# Altium project EL00016-AC Accumulator High Voltage PCB -Ethan Edit.PrjPcb (part 1 of 2)
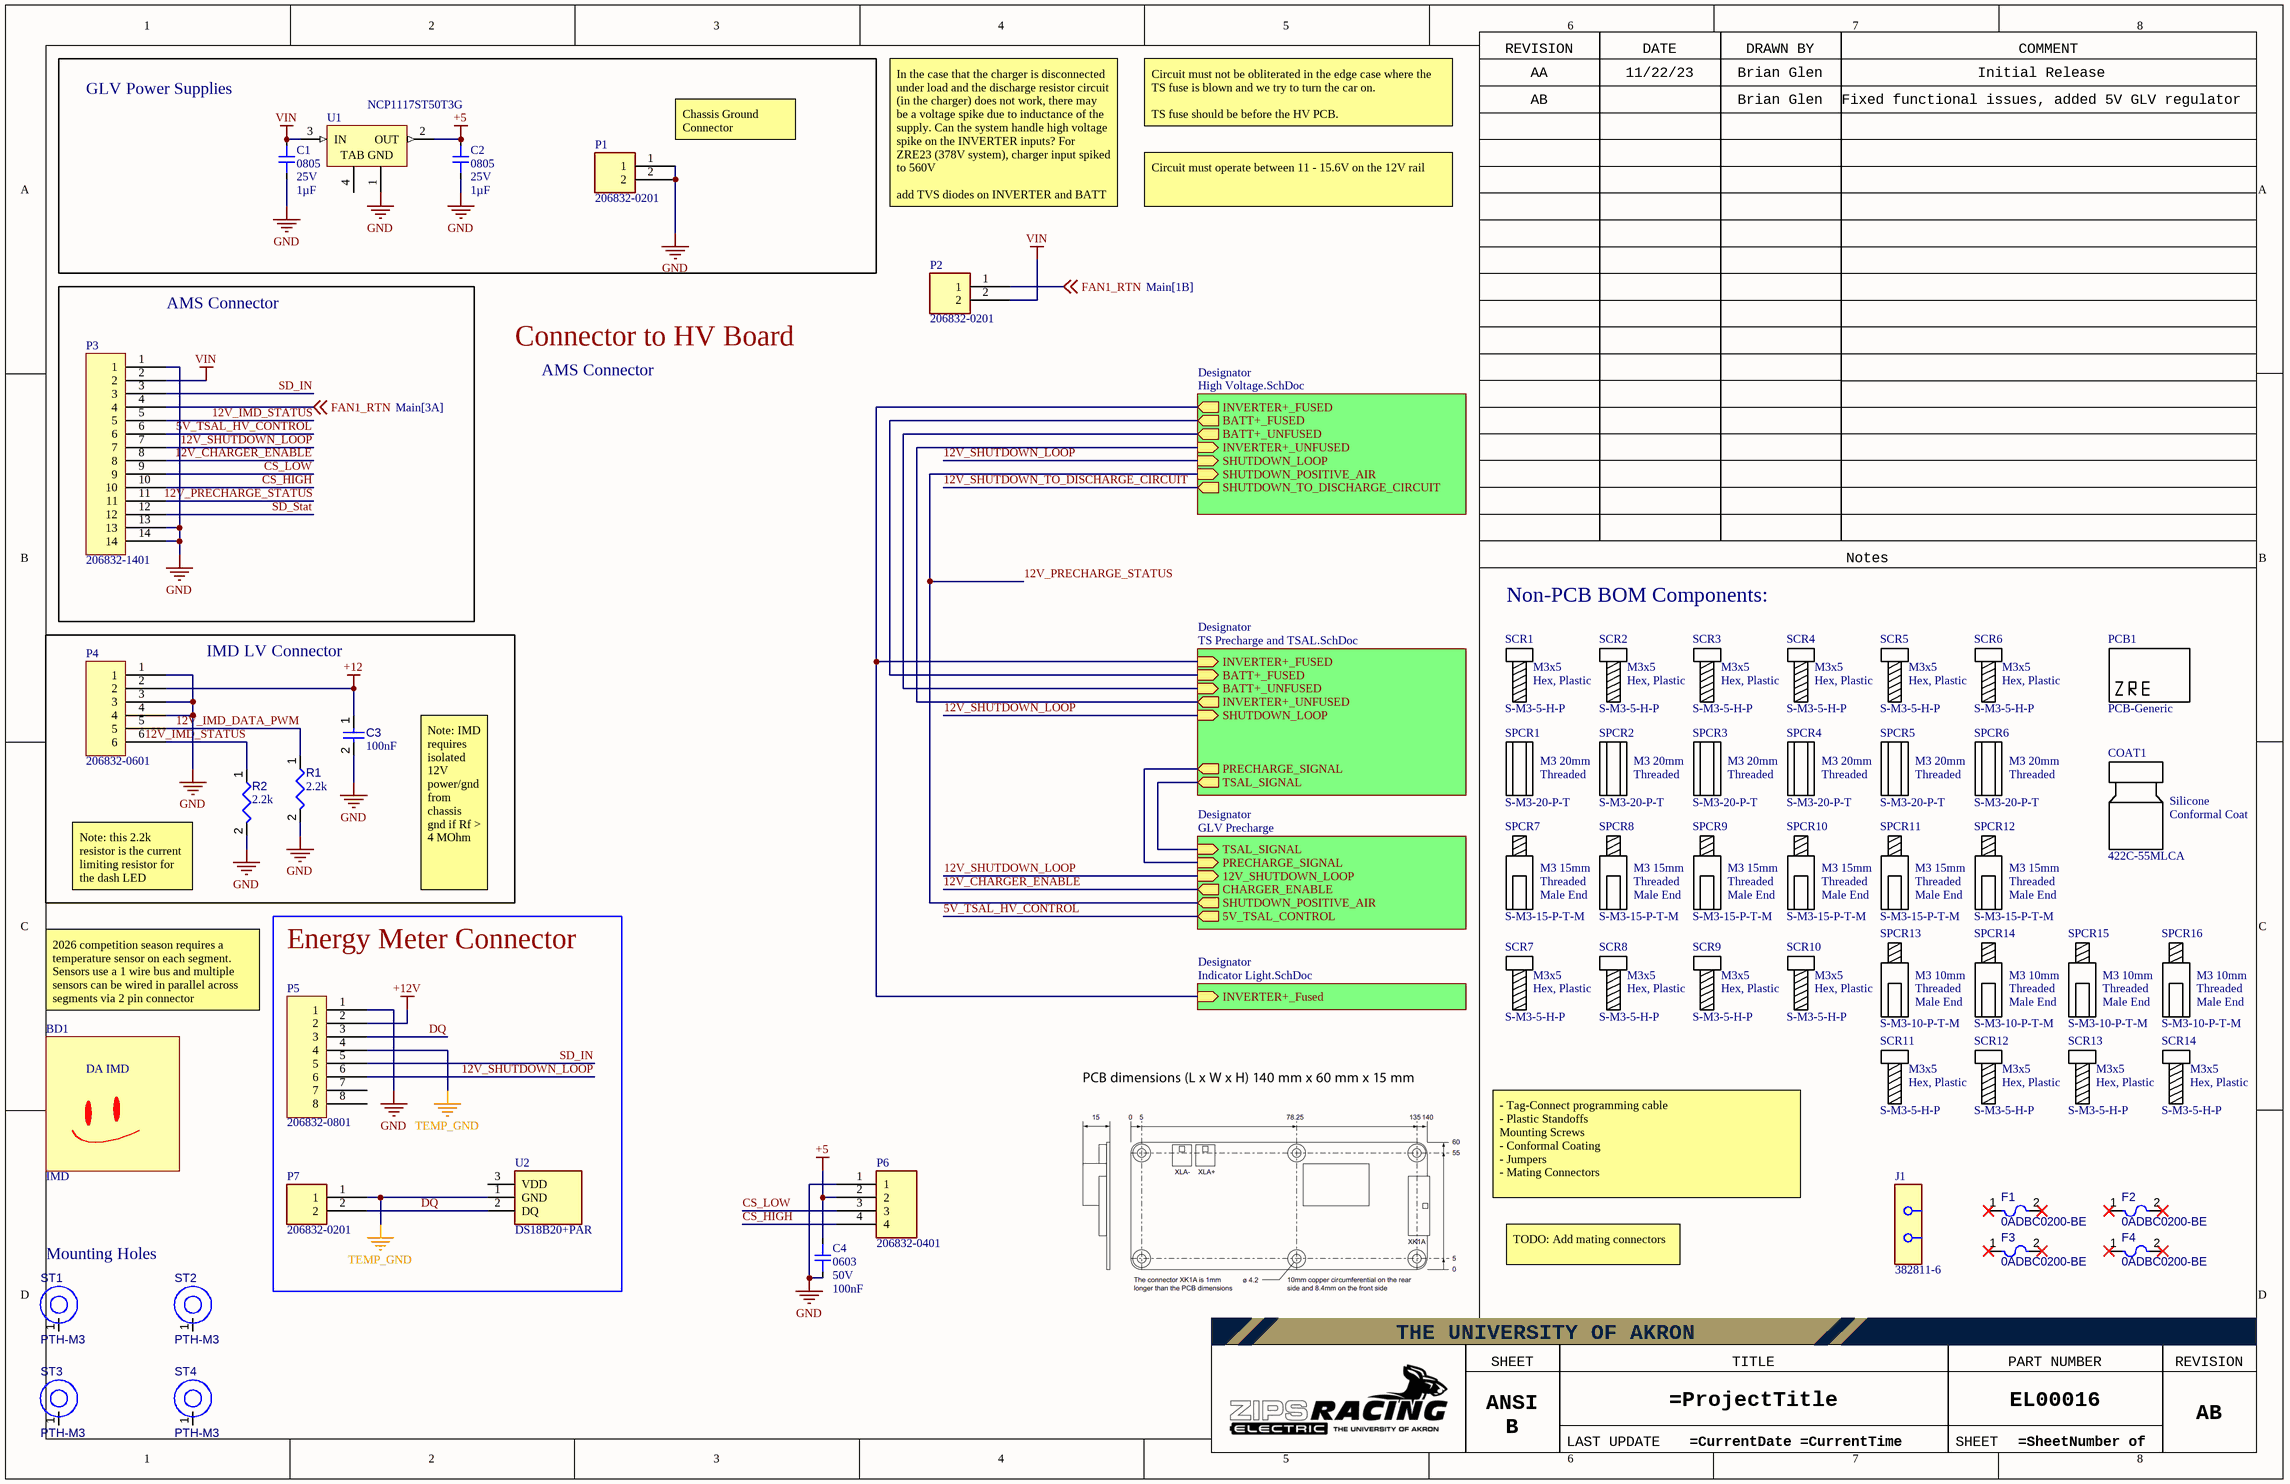
[diagram p0: Main.SchDoc]
Comment_1: Initial Release; Comment_2: Fixed functional issues, added 5V GLV regulator; Date_1: 11/22/23; DrawnBy_1: Brian Glen; DrawnBy_2: Brian Glen; PartNumber: EL00016; ProjectTitle: Accumulator High Voltage PCB; Revision: AB; Revision_1: AA; Revision_2: AB
5 sheets, 186 parts. Net scope: hierarchical (ports join the sheet entries above them; power ports are global).
Board file: PCB.PcbDoc
Sheets:
  Main.SchDoc
    Designator = TS Precharge and TSAL.SchDoc
    Designator = Indicator Light.SchDoc
    Designator = High Voltage.SchDoc
    Designator = GLV Precharge.SchDoc

## Sheet Main.SchDoc
size Tabloid; SheetNumber: 1; SheetTotal: 5

### Parts
BD1  IMD  [IMD-Footprint-1]
C1  value 1µF  Footprint: 0805  Voltage: 25V  [CAP-0805]  (hidden comment: Capacitor 1uF 0805 25V)
C2  value 1µF  Footprint: 0805  Voltage: 25V  [CAP-0805]  (hidden comment: Capacitor 1uF 0805 25V)
C3  value 100nF  [CAPC1608X90X40NL10T20]  (hidden comment: Capacitor 100 nF +/-10% 50 V 0603)
C4  value 100nF  Footprint: 0603  Voltage: 50V  [CAP-0603-Generic]  (hidden comment: Capacitor 100nF 0603 5%)
COAT1  422C-55MLCA  (mechanical)
F1  0ADBC0200-BE  (mechanical)
F2  0ADBC0200-BE  (mechanical)
F3  0ADBC0200-BE  (mechanical)
F4  0ADBC0200-BE  (mechanical)
J1  382811-6  [FP-382811-6-MFG]  (mechanical)
P1  206832-0201  [FP-206832-0201-MFG]
P2  206832-0201  [FP-206832-0201-MFG]
P3  206832-1401  [206832-1001-Footprint-1]
P4  206832-0601  [FP-206832-0601-MFG]
P5  206832-0801  [Copy of 206832-1001-Footprint-1]
P6  206832-0401  [MOLEX_2068320401]
P7  206832-0201  [FP-206832-0201-MFG]
PCB1  PCB-Generic  (mechanical)
R1  value 2.2k  [RESC1608X55X25LL10T15]  (hidden comment: Resistor 2.2k +/-1% 0603 100mW)
R2  value 2.2k  [RESC1608X55X25LL10T15]  (hidden comment: Resistor 2.2k +/-1% 0603 100mW)
SCR1  S-M3-5-H-P  (mechanical)
SCR2  S-M3-5-H-P  (mechanical)
SCR3  S-M3-5-H-P  (mechanical)
SCR4  S-M3-5-H-P  (mechanical)
SCR5  S-M3-5-H-P  (mechanical)
SCR6  S-M3-5-H-P  (mechanical)
SCR7  S-M3-5-H-P  (mechanical)
SCR8  S-M3-5-H-P  (mechanical)
SCR9  S-M3-5-H-P  (mechanical)
SCR10  S-M3-5-H-P  (mechanical)
SCR11  S-M3-5-H-P  (mechanical)
SCR12  S-M3-5-H-P  (mechanical)
SCR13  S-M3-5-H-P  (mechanical)
SCR14  S-M3-5-H-P  (mechanical)
SPCR1  S-M3-20-P-T  (mechanical)
SPCR2  S-M3-20-P-T  (mechanical)
SPCR3  S-M3-20-P-T  (mechanical)
SPCR4  S-M3-20-P-T  (mechanical)
SPCR5  S-M3-20-P-T  (mechanical)
SPCR6  S-M3-20-P-T  (mechanical)
SPCR7  S-M3-15-P-T-M  (mechanical)
SPCR8  S-M3-15-P-T-M  (mechanical)
SPCR9  S-M3-15-P-T-M  (mechanical)
SPCR10  S-M3-15-P-T-M  (mechanical)
SPCR11  S-M3-15-P-T-M  (mechanical)
SPCR12  S-M3-15-P-T-M  (mechanical)
SPCR13  S-M3-10-P-T-M  (mechanical)
SPCR14  S-M3-10-P-T-M  (mechanical)
SPCR15  S-M3-10-P-T-M  (mechanical)
SPCR16  S-M3-10-P-T-M  (mechanical)
ST1  PTH-M3  [PTH-M2D5X5]  (no BOM)
ST2  PTH-M3  [PTH-M2D5X5]  (no BOM)
ST3  PTH-M3  [PTH-M2D5X5]  (no BOM)
ST4  PTH-M3  [PTH-M2D5X5]  (no BOM)
U1  NCP1117ST50T3G  [ONSC-SOT-223-4-318H-01_A_V]
U2  DS18B20+PAR  [New footprint 1]

### Blocks framed on the sheet
GLV Power Supplies: C1 C2 P1 U1
AMS Connector: P3
IMD LV Connector: C3 P4 R1 R2
Energy Meter Connector: P5 P7 U2

### Sub-sheets
Designator = TS Precharge and TSAL.SchDoc: SHUTDOWN_LOOP (in), BATT+_UNFUSED (in), INVERTER+_UNFUSED (out), INVERTER+_FUSED (in), BATT+_FUSED (in), PRECHARGE_SIGNAL (out), TSAL_SIGNAL (out)
Designator = Indicator Light.SchDoc: INVERTER+_Fused (in)
Designator = High Voltage.SchDoc: SHUTDOWN_LOOP (in), SHUTDOWN_POSITIVE_AIR (in), SHUTDOWN_TO_DISCHARGE_CIRCUIT (out), INVERTER+_FUSED (out), BATT+_FUSED (out), BATT+_UNFUSED (out), INVERTER+_UNFUSED (in)
Designator = GLV Precharge: 5V_TSAL_CONTROL (out), SHUTDOWN_POSITIVE_AIR (out), CHARGER_ENABLE (out), PRECHARGE_SIGNAL (in), TSAL_SIGNAL (in), 12V_SHUTDOWN_LOOP (in)

### Nets
+5: C2.2 C4.2 P6.2 U1.2(OUT)
+12: C3.1 P4.2
+12V: P5.2
GND: C1.1 C2.1 C3.2 C4.1 P1.1 P1.2 P3.1 P3.13 P3.14 P4.1 P4.3 P4.4 P5.1 P6.1 R1.2 R2.2 U1.1(GND)
TEMP_GND: P5.4 P7.1 U2.1(GND)
VIN: C1.2 P2.2 P3.2 U1.3(IN)
5V_TSAL_HV_CONTROL: P3.6 ; sheet Designator/5V_TSAL_CONTROL
12V_CHARGER_ENABLE: P3.8 ; sheet Designator/CHARGER_ENABLE
12V_IMD_DATA_PWM: P4.5 R1.1
12V_IMD_STATUS: P3.5 P4.6 R2.1
12V_PRECHARGE_STATUS: P3.11 ; sheet Designator/SHUTDOWN_POSITIVE_AIR, sheet Designator/SHUTDOWN_POSITIVE_AIR
12V_SHUTDOWN_LOOP: P3.7 P5.6 ; sheet Designator/SHUTDOWN_LOOP, sheet Designator/SHUTDOWN_LOOP, sheet Designator/12V_SHUTDOWN_LOOP
12V_SHUTDOWN_TO_DISCHARGE_CIRCUIT: sheet Designator/SHUTDOWN_TO_DISCHARGE_CIRCUIT
BATT+_FUSED: sheet Designator/BATT+_FUSED, sheet Designator/BATT+_FUSED
BATT+_UNFUSED: sheet Designator/BATT+_UNFUSED, sheet Designator/BATT+_UNFUSED
CS_HIGH: P3.10 P6.4
CS_LOW: P3.9 P6.3
DQ: P5.3 P7.2 U2.2(DQ)
FAN1_RTN: P2.1 P3.4 ; off-sheet FAN1_RTN
INVERTER+_FUSED: sheet Designator/INVERTER+_FUSED, sheet Designator/INVERTER+_Fused, sheet Designator/INVERTER+_FUSED
INVERTER+_UNFUSED: sheet Designator/INVERTER+_UNFUSED, sheet Designator/INVERTER+_UNFUSED
SD_IN: P3.3 P5.5
SD_Stat: P3.12
NetR45_1: sheet Designator/PRECHARGE_SIGNAL, sheet Designator/PRECHARGE_SIGNAL
NetR46_1: sheet Designator/TSAL_SIGNAL, sheet Designator/TSAL_SIGNAL

Not connected (* = marked no-connect by the designer): F1 1* 2*; F2 1* 2*; F3 1* 2*; F4 1* 2*; P5 7 8; ST1 1(H1); ST2 1(H1); ST3 1(H1); ST4 1(H1); U1 4(TAB); U2 3(VDD)

### Notes on the sheet
- (near P1) Chassis Ground Connector
- Circuit must not be obliterated in the edge case where the TS fuse is blown and we try to turn the car on.
  TS fuse should be before the HV PCB.
- In the case that the charger is disconnected under load and the discharge resistor circuit (in the charger) does not work, there may be a voltage spike due to inductance of the supply. Can the system handle high voltage spike on the INVERTER inputs? For ZRE23 (378V system), charger input spiked to 560V
  add TVS diodes on INVERTER and BATT inputs, after fuses.
- Circuit must operate between 11 - 15.6V on the 12V rail
- Connector to HV Board
- AMS Connector
- Non-PCB BOM Components:
- Note: this 2.2k resistor is the current limiting resistor for the dash LED
- Note: IMD requires isolated 12V power/gnd from chassis gnd if Rf > 4 MOhm
- (near BD1) 2026 competition season requires a temperature sensor on each segment. Sensors use a 1 wire bus and multiple sensors can be wired in parallel across segments via 2 pin connector
- - Tag-Connect programming cable
  - Plastic Standoffs
  Mounting Screws
  - Conformal Coating
  - Jumpers
  - Mating Connectors
- Mounting Holes
- TODO: Add mating connectors
- REVISION
- DATE
- DRAWN BY
- COMMENT
- Notes
- THE UNIVERSITY OF AKRON
- SHEET SIZE
- TITLE
- PART NUMBER
- ANSI B
- LAST UPDATE
- SHEET
- (in symbol CMP-00028-00010-4) M3x5; Hex, Plastic
- (in symbol CMP-00028-00013-1) M3 20mm; Threaded
- (in symbol CMP-00028-00014-2) M3 15mm; Threaded; Male End
- (in symbol CMP-00028-00015-1) M3 10mm; Threaded; Male End
- (in symbol CMP-00030-00004-3) Silicone; Conformal Coat
- (in symbol CMP-00035-4) DA IMD

### Library data of the parts
BD1 = CMP-00035-4: IMD for the CAR
C1 C2 = CMP-00045-1: Capacitor, 0805
C3 = CMP-001-00017-6: Chip Capacitor, 100 nF, +/- 10%, 50 V, 0603 (1608 Metric); Voltage Rating: 50V; Capacitor Type: Ceramic; Tolerance: 10%; Mounting Technology: SM; Max Operating Temperature: 125°C; RoHS Compliant: True; Pins: 2; Case/Package: 0603; Min Operating Temperature: -55°C
C4 = CMP-00030-2: Capacitor, 0603, 5%; Max Operating Temperature: 125°C; Min Operating Temperature: -55°C
COAT1 = CMP-00030-00004-3: Silicone Conformal Coating, MG Chemicals, Clear, UL94 V-0, high Temperature, UV indicator, 55mL, Conform, Coat
F1-F4 = CMP-005-00015-1: Electric Fuse, Fast Blow, 0.2A, 1000VAC, 1000VDC, 0.2A (IR), Inline/holder, 6x32mm; RoHS Compliant: Yes
J1 = CMP-00030-00005-2: 2-Pin Header Pin Jumper, 0.1" pitch, Shunts/Jumper Connector; Body Length: 2.498inch; Contact Pattern: RECTANGULAR; Body Breadth: 0.2inch; Body Depth: 0.25inch; Number of Contacts: 2; Reliability: COMMERCIAL; Number Of Connectors: 1; Dielectric Withstanding Voltage (DC): 1kV; Durability: 25Cycles; Mating Contact Pitch: 0.1inch; Reference Standard: UL; Contact Resistance: 15mR; Connector Type: Interconnection Device; Insulation Resistance: 1GR; Plating Thickness: 15uin; Rated Current (Signal): 3A; Body/Shell Style: PLUG; Contact Style: SQ PIN-SKT; Contact Gender: Female; Contact Finish - Mating: AU ON NI; Insulation Material: Glass; Reach SVHC Compliant: Yes; Insulation Color: Black; Number of Rows Loaded: 1; RoHS Compliant: Yes; Mounting Style: STRAIGHT; Max Operating Temperature: 105°C; Contact Material: Bronze; Min Operating Temperature: -65°C
P1 P2 P7 = CMP-002-00123-3: Molex, Micro-Fit+, 2 Position, Dual-Row, Header, Male, 3mm Pitch; Max Current Rating: 13A; Voltage Rating: 600V
P3 = CMP-002-00137-1: MICRO-FIT Plus Header Assembly Dual Row 10 Position Straight Tin
P4 = CMP-002-00091-5: Molex, Micro-Fit+, 6 Position, Dual-Row, Header, Male, 3mm Pitch; Connector Type: PCB Header; Voltage Rating: 600V; Max Current Rating: 12.5A; Max Operating Temperature: 104°C; Pins: 6; Mounting Technology: Thru-hole; Gender: Male; Min Operating Temperature: -40°C
P5 = CMP-002-00132-2: MICRO-FIT Plus Header Assembly Dual Row 8 Position Straight Tin
P6 = CMP-002-00114-6: Micro-Fit+ Vertical Header, Through Hole, 3.00mm Pitch, Dual Row, 4 Circuits, Tin (Sn) Plating, Glow-Wire Capable, Black, Tray; Voltage Rating: 600V; Max Current Rating: 12.5A; Rows: 2; Mating Cycls: 25; Connector Type: PCB Header; Gender: Male; ComponentLink1Description: Datasheet; ComponentLink1URL: https://www.molex.com/en-us/products/part-detail/2068320401?display=pdf; Max Operating Temperature: 105°C; Plating Material: Tin; Mounting Technology: Thru-hole; Min Operating Temperature: -40°C; Pins: 4
PCB1 = CMP-00028-00012-1: Generic PCB Component for BOM inclusion
R1 R2 = CMP-009-00198-1: Description Chip Resistor, 2.2 KOhm, +/-1%, 0.1 W, -55 to 155 degC, 0603 (1608 Metric); Temperature Coefficient: 100ppm/°C; Rated Temperature: 70°C; Tolerance: 1%; Working Voltage: 75V; Case/Package: 0603; Power: 100mW; Mounting Technology: Surface Mount; Min Operating Temperature: -55°C; Max Operating Temperature: 155°C; RoHS Compliant: Yes; Pins: 2
SCR1-SCR14 = CMP-00028-00010-4: Generic Screw, M3, 5mm length, Hex Head, Plastic; Thread Pitch: 0.8mm; Material: Plastic; Pins: 0; Length: 5mm; Head Type: Hex; Thread Size: M3
SPCR1-SPCR6 = CMP-00028-00013-1: Generic M3 Spacer, 10 mm length, plastic, threaded; Pins: 0
SPCR7-SPCR12 = CMP-00028-00014-2: Generic M3 Spacer, 15 mm length, plastic, threaded, one male end; Pins: 0
SPCR13-SPCR16 = CMP-00028-00015-1: Generic M3 Spacer, 10 mm length, plastic, threaded, one male end; Pins: 0
ST1-ST4 = CMP-00028-00008-5: M3 Plated Thru-Hole  (3.2mm), 7mm pad, 10 mm keep out zone; Pins: 1
U1 = CMP-019-00031-3: Low-Dropout Positive Fixed Voltage Regulator, 1 A, 5 V Vout, 0 to 125 degC, 4-Pin SOT-223, Pb-Free, Tape and Reel; Manufacturer: ON Semiconductor; Current Rating: -600A; Output Voltage: 5V; Max Ouput Current: 1A; Max Input Voltage: 20V; Outputs: 1; Dropout Voltage: 1.2V; Min Input Voltage: 3.5V; Datasheet Version: Rev. 26, 08/2013; Package Quantity: 4000; Package Description: 4-Pin Small Outline Transistor, Body 6.5 x 3.5 mm, Pitch 2.3 mm; RoHS Compliant: True; Max Operating Temperature: 125°C; Nominal Output Voltage: 5V; Datasheet URL: https://datasheet.ciiva.com/28483/1748260-28483320.pdf; Min Operating Temperature: 0°C; Manufacturer URL: http://www.onsemi.com/; Output Current: 1A; Pins: 3; Mounting Technology: SM; Package Reference: SOT-223-4-318H-01_A; Case/Package: TO-261-4; Packaging: TapeandReel
U2 = CMP-015-00013-3: Serial Switch/Digital Sensor, 12 Bit(s), 0.50Cel, Rectangular, 3 Pin, Through Hole Mount

## Sheet TS Precharge and TSAL.SchDoc
size Tabloid; SheetNumber: 3; SheetTotal: 5
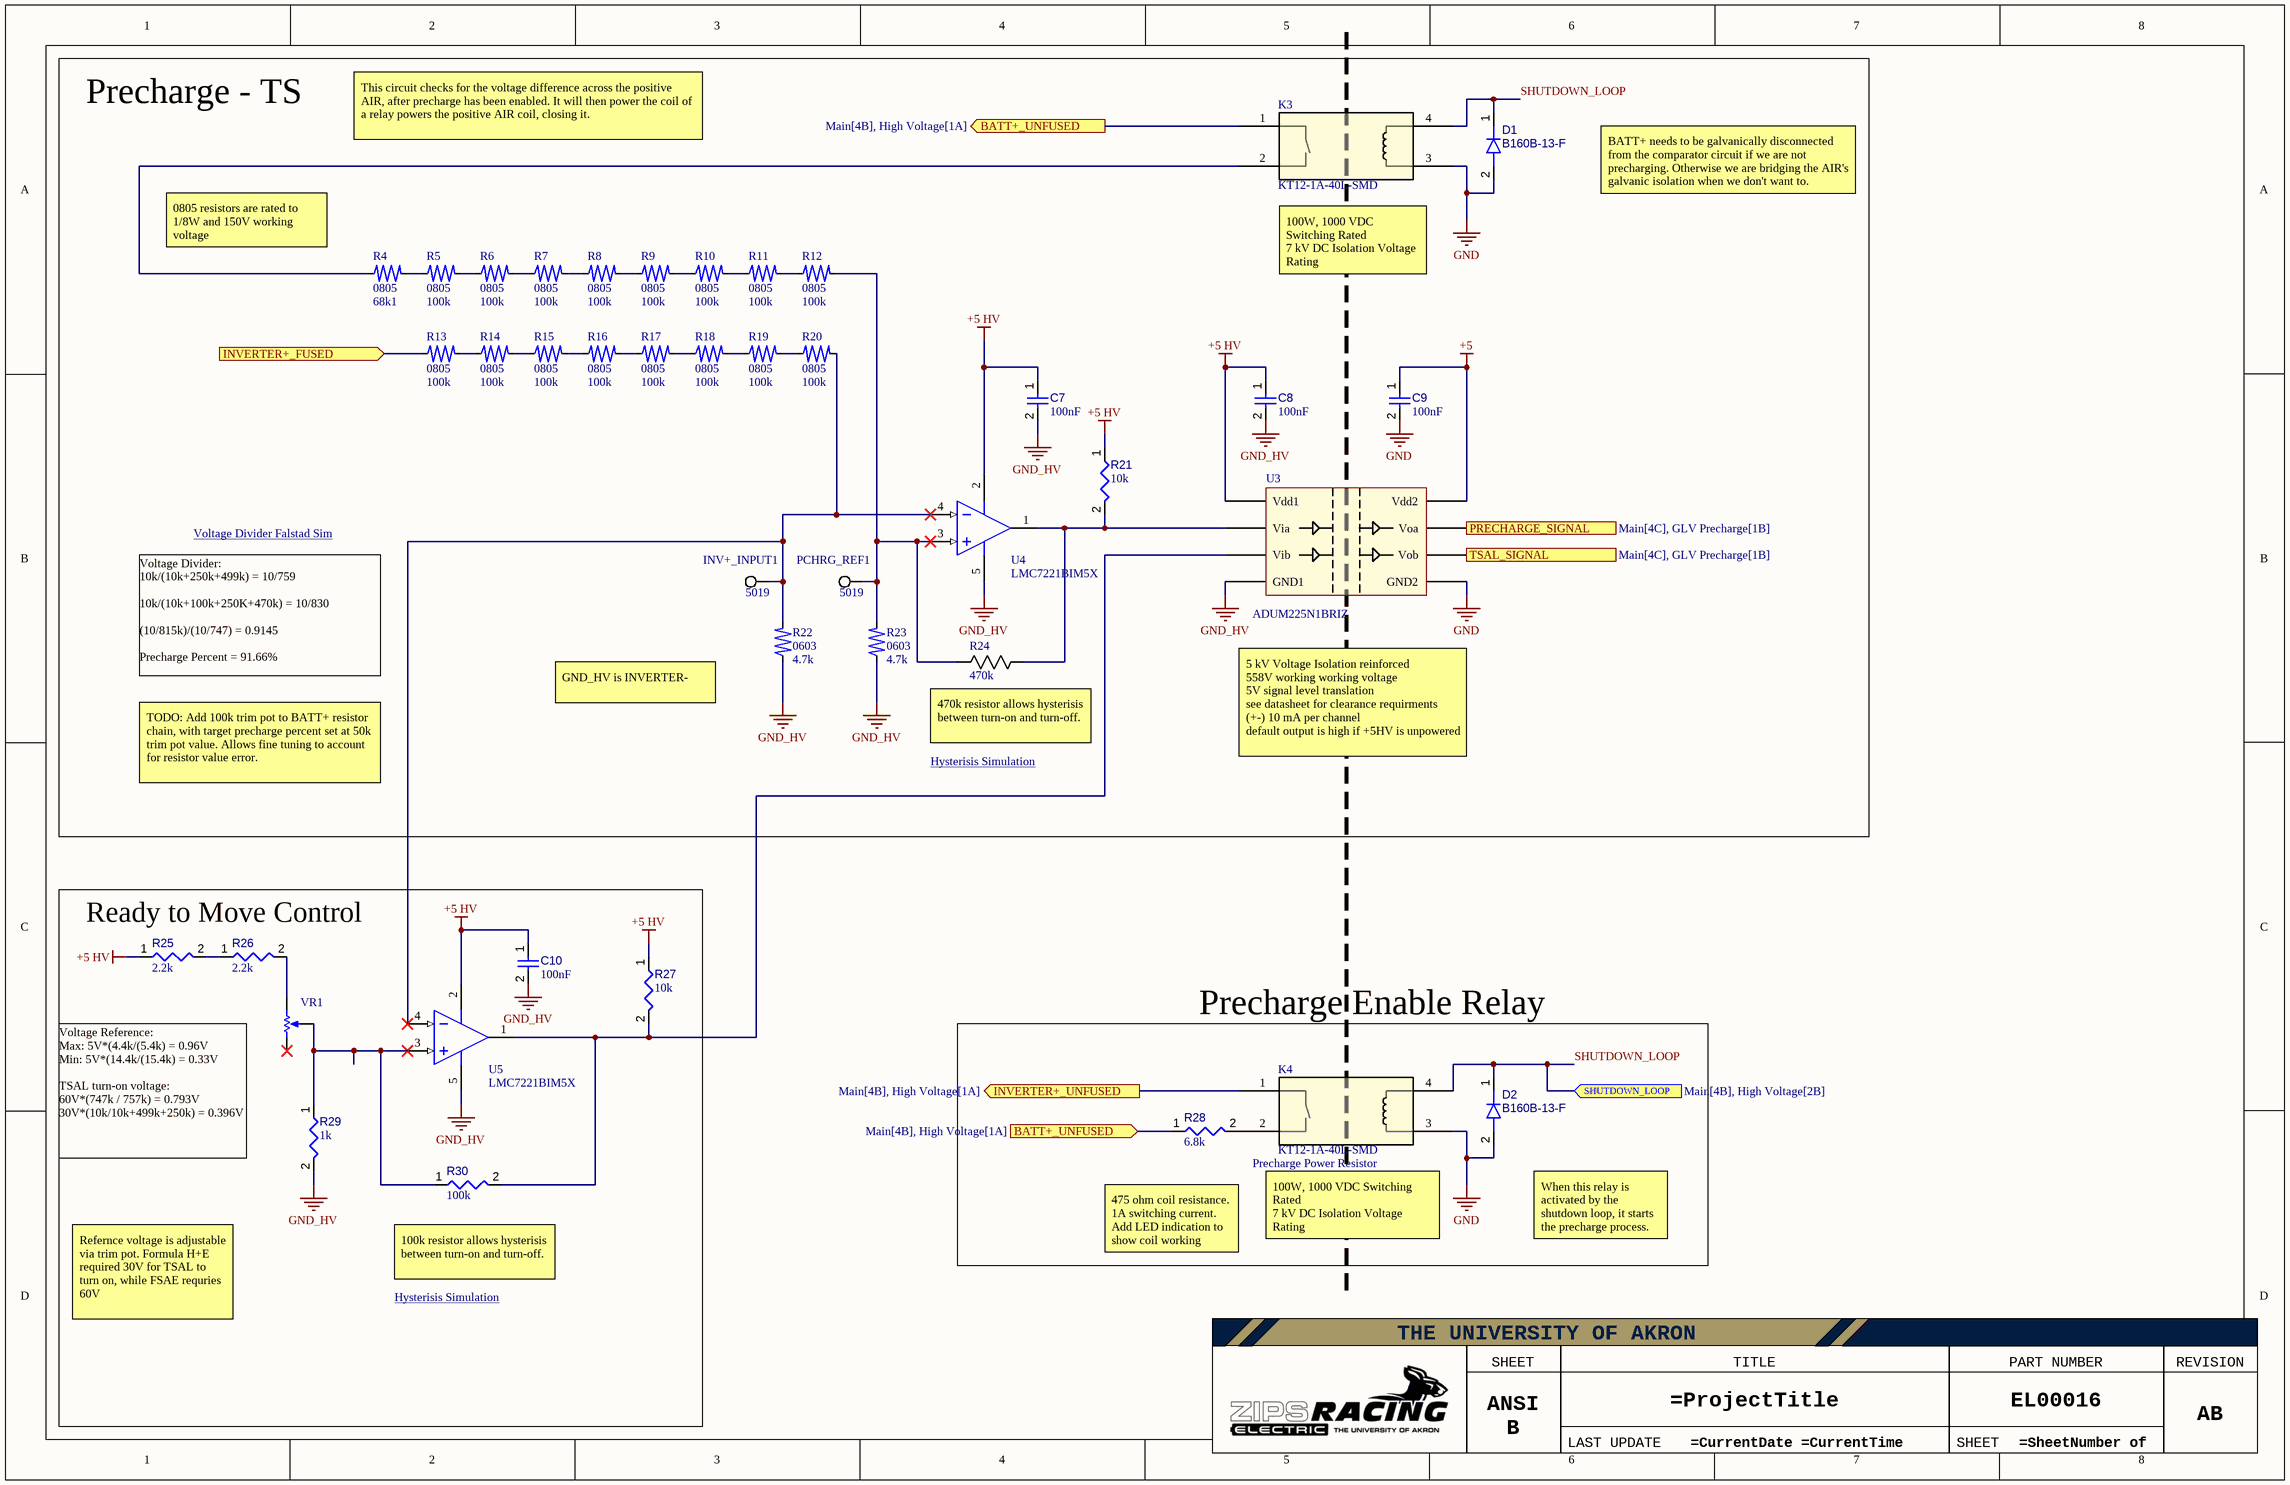
[diagram p1: TS Precharge and TSAL.SchDoc]

### Parts
C7  value 100nF  [CAPC1608X90X40NL10T20]  (hidden comment: Capacitor 100 nF +/-10% 50 V 0603)
C8  value 100nF  [CAPC1608X90X40NL10T20]  (hidden comment: Capacitor 100 nF +/-10% 50 V 0603)
C9  value 100nF  [CAPC1608X90X40NL10T20]  (hidden comment: Capacitor 100 nF +/-10% 50 V 0603)
C10  value 100nF  [CAPC1608X90X40NL10T20]  (hidden comment: Capacitor 100 nF +/-10% 50 V 0603)
D1  B160B-13-F  [FP-SMB-MFG]
D2  B160B-13-F  [FP-SMB-MFG]
INV+_INPUT1  5019  [KSTN-5019_V]
K3  KT12-1A-40L-SMD  [New footprint 1]
K4  KT12-1A-40L-SMD  [New footprint 1]
PCHRG_REF1  5019  [KSTN-5019_V]
R4  value 68k1  Footprint: 0805  [RES-0805-GENERIC]  (hidden comment: Resistor 68k1 0805 1%)
R5  value 100k  Footprint: 0805  [RES-0805-GENERIC]  (hidden comment: Resistor 100k 0805 1%)
R6  value 100k  Footprint: 0805  [RES-0805-GENERIC]  (hidden comment: Resistor 100k 0805 1%)
R7  value 100k  Footprint: 0805  [RES-0805-GENERIC]  (hidden comment: Resistor 100k 0805 1%)
R8  value 100k  Footprint: 0805  [RES-0805-GENERIC]  (hidden comment: Resistor 100k 0805 1%)
R9  value 100k  Footprint: 0805  [RES-0805-GENERIC]  (hidden comment: Resistor 100k 0805 1%)
R10  value 100k  Footprint: 0805  [RES-0805-GENERIC]  (hidden comment: Resistor 100k 0805 1%)
R11  value 100k  Footprint: 0805  [RES-0805-GENERIC]  (hidden comment: Resistor 100k 0805 1%)
R12  value 100k  Footprint: 0805  [RES-0805-GENERIC]  (hidden comment: Resistor 100k 0805 1%)
R13  value 100k  Footprint: 0805  [RES-0805-GENERIC]  (hidden comment: Resistor 100k 0805 1%)
R14  value 100k  Footprint: 0805  [RES-0805-GENERIC]  (hidden comment: Resistor 100k 0805 1%)
R15  value 100k  Footprint: 0805  [RES-0805-GENERIC]  (hidden comment: Resistor 100k 0805 1%)
R16  value 100k  Footprint: 0805  [RES-0805-GENERIC]  (hidden comment: Resistor 100k 0805 1%)
R17  value 100k  Footprint: 0805  [RES-0805-GENERIC]  (hidden comment: Resistor 100k 0805 1%)
R18  value 100k  Footprint: 0805  [RES-0805-GENERIC]  (hidden comment: Resistor 100k 0805 1%)
R19  value 100k  Footprint: 0805  [RES-0805-GENERIC]  (hidden comment: Resistor 100k 0805 1%)
R20  value 100k  Footprint: 0805  [RES-0805-GENERIC]  (hidden comment: Resistor 100k 0805 1%)
R21  value 10k  [RESC1608X55X25ML10T15]  (hidden comment: Resistor 10k +/-1% 0603 100 mW)
R22  value 4.7k  Footprint: 0603  [RES-0603-Generic]  (hidden comment: Resistor 4k7 0603 1%)
R23  value 4.7k  Footprint: 0603  [RES-0603-Generic]  (hidden comment: Resistor 4k7 0603 1%)
R24  value 470k  [R0603]  (hidden comment: RES_0603_470k)
R25  value 2.2k  [RESC1608X55X25LL10T15]  (hidden comment: Resistor 2.2k +/-1% 0603 100mW)
R26  value 2.2k  [RESC1608X55X25LL10T15]  (hidden comment: Resistor 2.2k +/-1% 0603 100mW)
R27  value 10k  [RESC1608X55X25ML10T15]  (hidden comment: Resistor 10k +/-1% 0603 100 mW)
R28  value 6.8k  [New footprint 1]  (hidden comment: HSA506K8J)
R29  value 1k  [RESC1608X55X25ML10T15]  (hidden comment: Resistor 1k +/-1% 0603 100 mW)
R30  value 100k  [RESC1608X55X25ML10T15]  (hidden comment: Resistor 100k +/-1% 0603 100 mW)
U3  ADUM225N1BRIZ  [SOIC127P1030X265-8N]
U4  LMC7221BIM5X  [DBV0005A_L]
U5  LMC7221BIM5X  [DBV0005A_L]
VR1  3362P-1-103LF  [BOUR-3362P]  (value not drawn)

### Blocks framed on the sheet
Precharge - TS: C7-C9 D1 INV+_INPUT1 K3 PCHRG_REF1 R4-R24 U3 U4
Ready to Move Control: C10 R25-R27 R29 R30 U5 VR1
Precharge Enable Relay: D2 K4 R28

### Ports
BATT+_UNFUSED (in, see Main[4B], High Voltage[1A]), BATT+_UNFUSED (out, see Main[4B], High Voltage[1A]), INVERTER+_FUSED (in, see Main[4B], High Voltage[1A], Indicator Light[2A]), INVERTER+_UNFUSED (out, see Main[4B], High Voltage[1A]), PRECHARGE_SIGNAL (out, see Main[4C], GLV Precharge[1B]), SHUTDOWN_LOOP (in, see Main[4B], High Voltage[2B]), TSAL_SIGNAL (out, see Main[4C], GLV Precharge[1B])

### Nets
+5: C9.1 U3.8(Vdd2)
+5 HV: C7.1 C8.1 C10.1 R21.1 R25.1 R27.1 U3.1(Vdd1) U4.2(V+) U5.2(V+)
GND: C9.2 D1.2(A) D2.2(A) K3.3 K4.3 U3.5(GND2)
GND_HV: C7.2 C8.2 C10.2 R22.1 R23.1 R29.2 U3.4(GND1) U4.5(V-) U5.5(V-)
BATT+_UNFUSED: K3.1 R28.1 ; port BATT+_UNFUSED
INVERTER+_FUSED: R13.1 ; port INVERTER+_FUSED
INVERTER+_UNFUSED: K4.1 ; port INVERTER+_UNFUSED
SHUTDOWN_LOOP: D1.1(K) D2.1(K) K3.4 K4.4 ; port SHUTDOWN_LOOP  [project net 12V_SHUTDOWN_LOOP]
NetINV+_INPUT1_1: INV+_INPUT1.1 R20.2 R22.2 U4.4(IN-) U5.4(IN-)
NetK3_2: K3.2 R4.1
NetK4_2: K4.2 R28.2
NetPCHRG_REF1_1: PCHRG_REF1.1 R12.2 R23.2 R24.1 U4.3(IN+)
NetR4_2: R4.2 R5.1
NetR5_2: R5.2 R6.1
NetR6_2: R6.2 R7.1
NetR7_2: R7.2 R8.1
NetR8_2: R8.2 R9.1
NetR9_2: R9.2 R10.1
NetR10_2: R10.2 R11.1
NetR11_2: R11.2 R12.1
NetR13_2: R13.2 R14.1
NetR14_2: R14.2 R15.1
NetR15_2: R15.2 R16.1
NetR16_2: R16.2 R17.1
NetR17_2: R17.2 R18.1
NetR18_2: R18.2 R19.1
NetR19_2: R19.2 R20.1
NetR21_2: R21.2 R24.2 U3.2(Via) U4.1(OUT)
NetR25_2: R25.2 R26.1
NetR26_2: R26.2 VR1.3(CW)
NetR27_2: R27.2 R30.2 U3.3(Vib) U5.1(OUT)
NetR29_1: R29.1 R30.1 U5.3(IN+) VR1.2(S)
NetR45_1: U3.7(Voa) ; port PRECHARGE_SIGNAL
NetR46_1: U3.6(Vob) ; port TSAL_SIGNAL

Not connected (* = marked no-connect by the designer): VR1 1(CCW)*

### Notes on the sheet
- This circuit checks for the voltage difference across the positive AIR, after precharge has been enabled. It will then power the coil of a relay powers the positive AIR coil, closing it.
- BATT+ needs to be galvanically disconnected from the comparator circuit if we are not precharging. Otherwise we are bridging the AIR's galvanic isolation when we don't want to.
- 0805 resistors are rated to 1/8W and 150V working voltage
- (near K3) 100W, 1000 VDC Switching Rated
  7 kV DC Isolation Voltage Rating
- Voltage Divider Falstad Sim <https://tinyurl.com/ywocnskm>
- Voltage Divider:
  10k/(10k+250k+499k) = 10/759
  10k/(10k+100k+250K+470k) = 10/830
  (10/815k)/(10/747) = 0.9145
  Precharge Percent = 91.66%
- GND_HV is INVERTER-
- Hysterisis Simulation <https://tinyurl.com/272h4edf>
- (near R24) 470k resistor allows hysterisis between turn-on and turn-off.
- 5 kV Voltage Isolation reinforced
  558V working working voltage
  5V signal level translation
  see datasheet for clearance requirments
  (+-) 10 mA per channel
  default output is high if +5HV is unpowered
- TODO: Add 100k trim pot to BATT+ resistor chain, with target precharge percent set at 50k trim pot value. Allows fine tuning to account for resistor value error.
- (near VR1) Voltage Reference:
  Max: 5V*(4.4k/(5.4k) = 0.96V
  Min: 5V*(14.4k/(15.4k) = 0.33V
  TSAL turn-on voltage:
  60V*(747k / 757k) = 0.793V
  30V*(10k/10k+499k+250k) = 0.396V
- Precharge Power Resistor
- 100W, 1000 VDC Switching Rated
  7 kV DC Isolation Voltage Rating
- When this relay is activated by the shutdown loop, it starts the precharge process.
- Hysterisis Simulation <https://tinyurl.com/22o4delq>
- (near R30) 100k resistor allows hysterisis between turn-on and turn-off.
- 475 ohm coil resistance. 1A switching current. Add LED indication to show coil working
- Refernce voltage is adjustable via trim pot. Formula H+E required 30V for TSAL to turn on, while FSAE requries 60V
- THE UNIVERSITY OF AKRON
- SHEET SIZE
- TITLE
- PART NUMBER
- REVISION
- ANSI B
- LAST UPDATE
- SHEET

### Library data of the parts
C7-C10 = CMP-001-00017-6: as C3 on sheet Main; Tolerance: 10%; Mounting Technology: SM; Max Operating Temperature: 125°C; RoHS Compliant: True; Pins: 2; Case/Package: 0603; Min Operating Temperature: -55°C
D1 D2 = CMP-004-00032-1: Rectifier Diode, Schottky, 1 Phase, 1 Element, 1A, 60V V(RRM), Silicon; Forward Voltage: 700mV; Qualification Status: Not Qualified; RoHS Compliant: Yes; Surface Mount: Yes; Max Operating Temperature: 150°C; Max Output current: 1A; Min Operating Temperature: -65°C; Technology: SCHOTTKY; Pins: 2
INV+_INPUT1 PCHRG_REF1 = CMP-00012-1: Interconnection Device
K3 K4 = CMP-008-00007-2: Reed Relay 12VDC 475Ohm 1A SPST-NO(30.2x17x8.7)mm SMD Dry Automotive; Coil Current: 25mA; Coil Resistance: 475R; Coil Power: 303mW; Height: 8.7mm; Max Operating Temperature: 100°C; Case/Package: SMD/SMT; ComponentLink1URL: https://4a30d8fd18dae1bf393d-df49f4cedb726ad03ad145d2e3d346bd.ssl.cf5.rackcdn.com/datasheets/90/9012185401e.pdf; ComponentLink1Description: Datasheet
R4 = CMP-00088-1: Resistor, 0805, 1%, 1/10W; Power: 125mW; Datasheet: https://www.seielect.com/catalog/sei-rmcf_rmcp.pdf; Tolerance: 1%; Max Operating Temperature: 155°C; Min Operating Temperature: -55°C
R5-R20 = CMP-00087-1: Resistor, 0805, 1%, 1/10W; Tolerance: 5%; Power: 125mW; Datasheet: https://www.seielect.com/catalog/sei-rmcf_rmcp.pdf; Min Operating Temperature: -55°C; Max Operating Temperature: 155°C
R21 R27 = CMP-009-00017-5: Chip Resistor, 10 KOhm, +/- 1%, 01 W, -55 to 155 degC, 0603 (1608 Metric); Voltage Rating: 50V; Power: 100mW; RoHS Compliant: True; Min Operating Temperature: -55°C; Pins: 2; Case/Package: 0603; Mounting Technology: SM; Max Operating Temperature: 155°C; Tolerance: 1%
R22 R23 = CMP-00023-4: Resistor, 0603, 1%, 1/10W; Power: 100mW; Tolerance: 1%; Max Operating Temperature: 155°C; Min Operating Temperature: -55°C; Datasheet: https://www.seielect.com/catalog/sei-rmcf_rmcp.pdf
R24 = CMP-009-00246-1: RES SMD 470K OHM 1% 0603; Manufacturer_Part_Number: RC0603JR-070RL; Built_By: EMA_UL_Team; SourceLibrary: Yageo_2018-12-15; Vendor: Yageo; Source: Zips_Racing_Electric.SchLib; Type: DEV; RefDes: RefDes; Copyright: Copyright (C) 2018 Accelerated Designs. All rights reserved; Case/Package: 0603; Design Item ID: RES_0603_470k
R25 R26 = CMP-009-00198-1: as R1 on sheet Main; Case/Package: 0603; Power: 100mW; Mounting Technology: Surface Mount; Min Operating Temperature: -55°C; Max Operating Temperature: 155°C; RoHS Compliant: Yes; Pins: 2
R28 = CMP-00064-2: Fixed Resistor, Wire Wound, 50W, 6800ohm, 1250V, 5% +/-Tol, 30ppm/Cel, Chassis Mount; RoHS Compliant: Yes; Mounting Technology: Chassis Mount; Pins: 2; Tolerance: 5%; Power: 50W; Max Operating Temperature: 250°C
R29 = CMP-009-00014-5: Chip Resistor, 1 KOhm, +/-1%, 0.1 W, -55 to 155 degC, 0603 (1608 Metric); Voltage Rating: 50V; Power: 100mW; Tolerance: 1%; Mounting Technology: SM; Pins: 2; Case/Package: 0603; Min Operating Temperature: -55°C; RoHS Compliant: True; Max Operating Temperature: 155°C
R30 = CMP-009-00023-5: Chip Resistor, 100 KOhm, +/- 1%, 0.1 W, -55 to 155 degC, 0603 (1608 Metric); Voltage Rating: 50V; Power: 100mW; Max Operating Temperature: 155°C; RoHS Compliant: True; Tolerance: 1%; Pins: 2; Case/Package: 0603; Mounting Technology: SM; Min Operating Temperature: -55°C
U3 = CMP-015-00008-2: Analog Circuit, 1 Func, CMOS, PDSO8; Max Supply Voltage: 5V; Min Supply Voltage: 1.7V; Nominal Supply Voltage: 1.8V; Surface Mount: Yes; Max Operating Temperature: 125°C; Case/Package: SOP; Temperature Grade: AUTOMOTIVE; RoHS Compliant: Yes; Technology: CMOS; Min Operating Temperature: -40°C; Pins: 8
U4 U5 = CMP-016-00012-2: Tiny CMOS Comparator with ail-to- ail Input and Open Drain Output 5-SOT-23 -40 to 85; Output Type: OPEN-DRAIN; Nominal Supply Voltage: 5V; Power Supplies: 2.7/15V; RoHS Compliant: No; Pins: 5; Case/Package: LSSOP; Technology: CMOS; Min Operating Temperature: -40°C; Surface Mount: Yes; Amplifier Type: COMPARATOR; Max Operating Temperature: 85°C
VR1 = CMP-009-00039-2: Square Trimpot(R) Trimming Potentiometer, 10 KOhm, 300 V, -55 to 125 degC, 3-Pin THD, RoHS, Tube; Manufacturer: Bourns; Tolerance: 10%; Power: 500mW; Voltage Rating: 300V; Resistance: 10k; Packaging: Rail/Tube; Package Reference: 3326P; Manufacturer URL: http://www.bourns.com/; Composition: Potentiometer; Package Description: 3-Pin Through Hole Device, Body 6.6 x 6.99 mm, Pitch 2.54 mm; Max Operating Temperature: 125°C; Min Operating Temperature: -55°C; Datasheet Version: May-16; Lead Pitch: 2.54mm; Pins: 3; Datasheet URL: http://www.bourns.com/docs/Product-Datasheets/3362.pdf; Package Quantity: 250; Case/Package: 3326P; RoHS Compliant: True; Mounting Technology: TH

## Sheet Indicator Light.SchDoc
size Tabloid; SheetNumber: 4; SheetTotal: 5
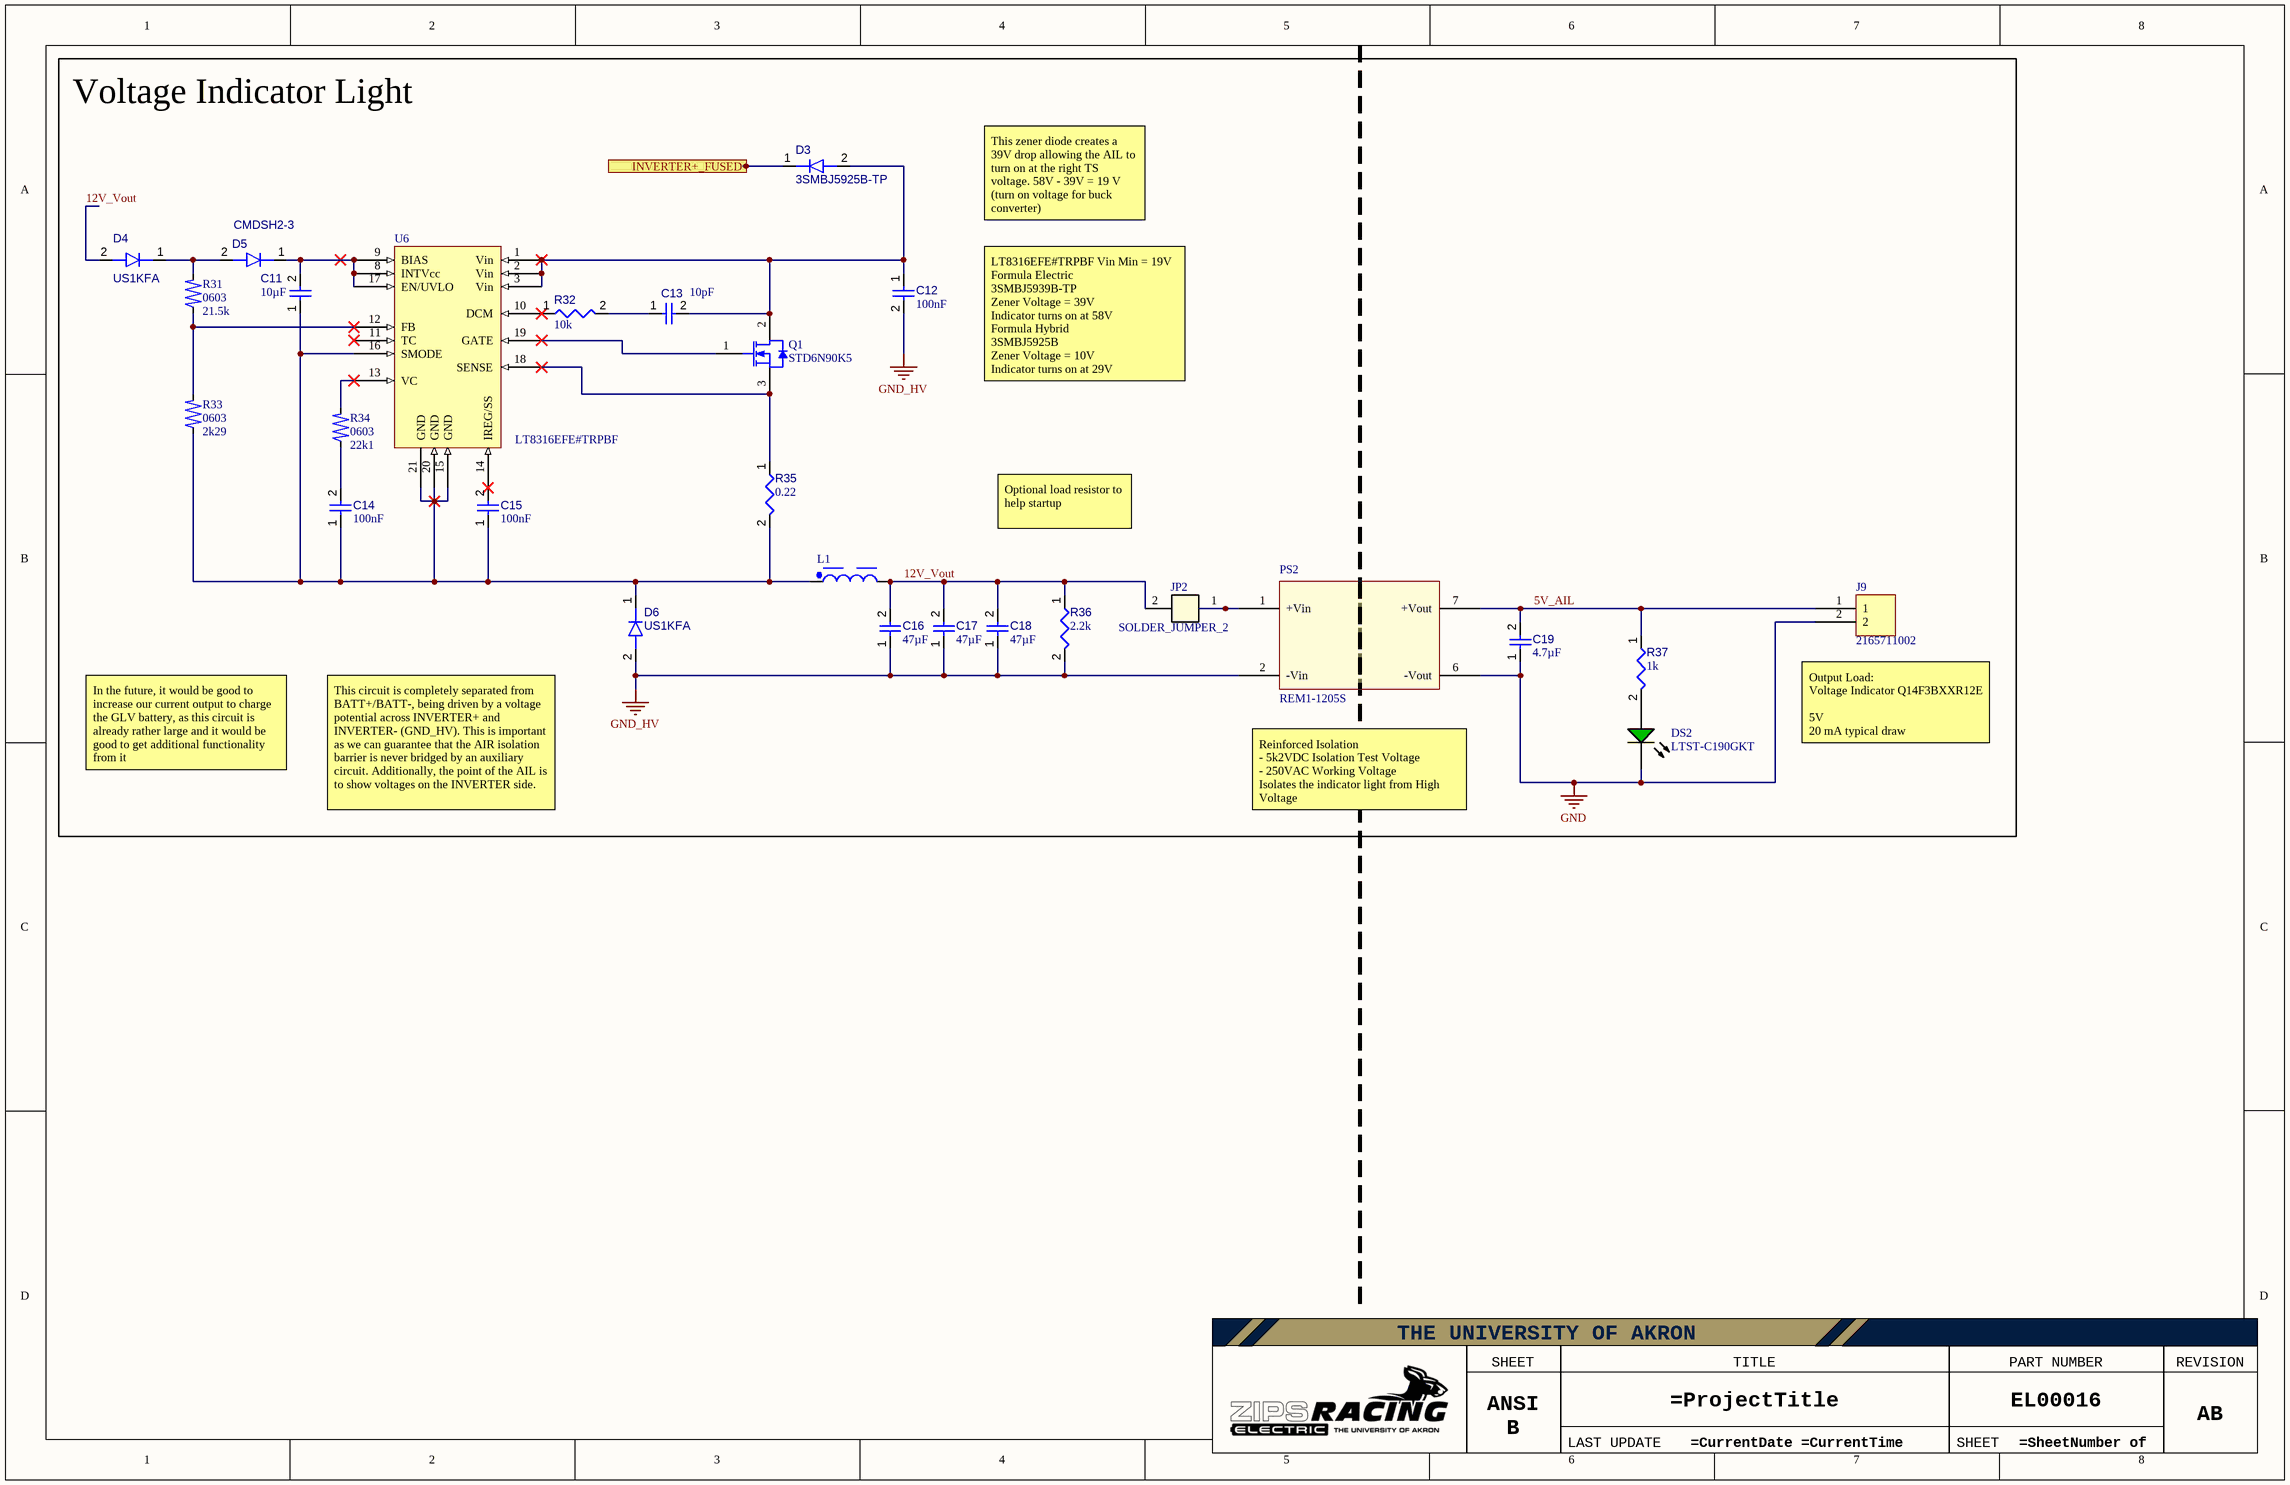
[diagram p2: Indicator Light.SchDoc]

### Parts
C11  value 10µF  [CAPC0805(2012)145_L]  (hidden comment: Capacitor 10µF +/-20% 25V 0805)
C12  value 100nF  [FP-GCJ55D-0_4-MFG]  (hidden comment: C1812C104KDRAC7800)
C13  value 10pF  [C1206C100FGGAC7800-Footprint-1]  (hidden comment: C1206C100FGGAC7800)
C14  value 100nF  [CAPC1608X90X40NL10T20]  (hidden comment: Capacitor 100 nF +/-10% 50 V 0603)
C15  value 100nF  [CAPC1608X90X40NL10T20]  (hidden comment: Capacitor 100 nF +/-10% 50 V 0603)
C16  value 47µF  [CAPC0805(2012)145_L]  (hidden comment: Capacitor 47µF +/-40% 6.3V 0805)
C17  value 47µF  [CAPC0805(2012)145_L]  (hidden comment: Capacitor 47µF +/-40% 6.3V 0805)
C18  value 47µF  [CAPC0805(2012)145_L]  (hidden comment: Capacitor 47µF +/-40% 6.3V 0805)
C19  value 4.7µF  [CAPC0805(2012)145_L]  (hidden comment: Capacitor 4.7µF +/-40% 25V 0805)
D3  3SMBJ5925B-TP  [SMBJ15A-Footprint-1]
D4  US1KFA  [DIOM2818X14N]
D5  CMDSH2-3  [CMDSH2-3-Footprint-1]
D6  US1KFA  [DIOM2818X14N]
DS2  LTST-C190GKT  [LTST-C190GKT_V]
J9  2165711002  [FP-216571-1002-MFG]
JP2  SOLDER_JUMPER_2  [C0603_JUMPER]  (no BOM)
L1  7687714102  [WE-PD HV_1060]  (value not drawn)
PS2  REM1-1205S  [REM1-1205S-Footprint-1]
Q1  STD6N90K5  [STD6N90K5-Footprint-1]
R31  value 21.5k  Footprint: 0603  [RES-0603-Generic]  (hidden comment: Resistor 21k5 0603 1%)
R32  value 10k  [RESC1608X55X25ML10T15]  (hidden comment: Resistor 10k +/-1% 0603 100 mW)
R33  value 2k29  Footprint: 0603  [RES-0603-Generic]  (hidden comment: Resistor 2k49 0603 1%)
R34  value 22k1  Footprint: 0603  [RES-0603-Generic]  (hidden comment: Resistor 22k1 0603 1%)
R35  value 0.22  [RESC3216X70X50NL05T20]  (hidden comment: ERJ-8BQFR22V)
R36  value 2.2k  [RESC1608X55X25LL10T15]  (hidden comment: Resistor 2.2k +/-1% 0603 100mW)
R37  value 1k  [RESC1608X55X25ML10T15]  (hidden comment: Resistor 1k +/-1% 0603 100 mW)
U6  LT8316EFE#TRPBF  [LT8316EFE#TRPBF-Footprint-1]

### Blocks framed on the sheet
Voltage Indicator Light: C11-C19 D3-D6 DS2 J9 JP2 L1 PS2 Q1 R31-R37 U6

### Ports
INVERTER+_FUSED (in, see Main[4C], High Voltage[1A], TS Precharge and TSAL[1A])

### Nets
GND: C19.1 DS2.2(K) J9.2 PS2.6(-Vout)
GND_HV: C12.2 C16.1 C17.1 C18.1 D6.2(A) PS2.2(-Vin) R36.2
5V_AIL: C19.2 J9.1 PS2.7(+Vout) R37.1
12V_Vout: C16.2 C17.2 C18.2 D4.2(A) JP2.2 L1.2 R36.1
INVERTER+_FUSED: D3.1(K) ; port INVERTER+_FUSED
NetC11_1: C11.1 C14.1 C15.1 D6.1(K) L1.1 R33.1 R35.2 U6.15(GND) U6.16(SMODE) U6.20(GND) U6.21(GND)
NetC11_2: C11.2 D5.1(K) U6.8(INTVcc) U6.9(BIAS) U6.17(EN/UVLO)
NetC12_1: C12.1 C13.2 D3.2(A) Q1.2(D) U6.1(Vin) U6.2(Vin) U6.3(Vin)
NetC13_1: C13.1 R32.2
NetC14_2: C14.2 R34.1
NetC15_2: C15.2 U6.14(IREG/SS)
NetD4_1: D4.1(K) D5.2(A) R31.2
NetDS2_1: DS2.1(A) R37.2
NetJP2_1: JP2.1 PS2.1(+Vin)
NetQ1_1: Q1.1(G) U6.19(GATE)
NetQ1_3: Q1.3(S) R35.1 U6.18(SENSE)
NetR31_1: R31.1 R33.2 U6.12(FB)
NetR32_1: R32.1 U6.10(DCM)
NetR34_2: R34.2 U6.13(VC)

Not connected (* = marked no-connect by the designer): PS2 3(NC) 4(NC) 5(NC); U6 11(TC)*

### Notes on the sheet
- This zener diode creates a 39V drop allowing the AIL to turn on at the right TS voltage. 58V - 39V = 19 V (turn on voltage for buck converter)
- LT8316EFE#TRPBF Vin Min = 19V
  Formula Electric
  3SMBJ5939B-TP
  Zener Voltage = 39V
  Indicator turns on at 58V
  Formula Hybrid
  3SMBJ5925B
  Zener Voltage = 10V
  Indicator turns on at 29V
- Optional load resistor to help startup
- In the future, it would be good to increase our current output to charge the GLV battery, as this circuit is already rather large and it would be good to get additional functionality from it
- (near J9) Output Load:
  Voltage Indicator Q14F3BXXR12E
  5V
  20 mA typical draw
- This circuit is completely separated from BATT+/BATT-, being driven by a voltage potential across INVERTER+ and INVERTER- (GND_HV). This is important as we can guarantee that the AIR isolation barrier is never bridged by an auxiliary circuit. Additionally, the point of the AIL is to show voltages on the INVERTER side.
- Reinforced Isolation
  - 5k2VDC Isolation Test Voltage
  - 250VAC Working Voltage
  Isolates the indicator light from High Voltage
- THE UNIVERSITY OF AKRON
- SHEET SIZE
- TITLE
- PART NUMBER
- REVISION
- ANSI B
- LAST UPDATE
- SHEET

### Library data of the parts
C11 = CMP-001-00079-4: Chip Capacitor, 10µF +/-20%, 25V, 0805, Thickness 1.45 mm; Tolerance: 10%; Max Operating Temperature: 85°C; Case/Package: 0805; Voltage Rating: 25V; Min Operating Temperature: -55°C; Mounting Technology: SMT; Pins: 2
C12 = CMP-001-00116-1: Ceramic Capacitor, Multilayer, Ceramic, 1000V, 10% +Tol, 10% -Tol, X7R, 15% TC, 0.1uF, Surface Mount, 2220; Rated DC Voltage (URdc): 1kV; Height: 2mm; Length: 5.7mm; Max Operating Temperature: 125°C; Pins: 2; Capacitor Type: Ceramic; RoHS Compliant: Yes; Mounting Technology: Surface Mount; Dielectric Material: Ceramic; Case/Package: 2220; Min Operating Temperature: -55°C
C13 = CMP-001-00115-2: CAP CER SMD 1206 10PF 2KV 1% COG; Capacitor Type: Ceramic; Max Operating Temperature: 125°C; Case/Package: 1206; Min Operating Temperature: -50°C; Tolerance: 1%; Voltage Rating: 2kV; Mounting Technology: SMT
C14 C15 = CMP-001-00017-6: as C3 on sheet Main; Tolerance: 10%; Mounting Technology: SM; Max Operating Temperature: 125°C; RoHS Compliant: True; Pins: 2; Case/Package: 0603; Min Operating Temperature: -55°C
C16-C18 = CMP-001-00082-4: Chip Capacitor, 47µF +/-40%, 6.3V, 0805, Thickness 1.45 mm; Tolerance: 10%; Min Operating Temperature: -55°C; Max Operating Temperature: 85°C; Case/Package: 0805; Pins: 2; Mounting Technology: SMT; Voltage Rating: 6.3V
C19 = CMP-001-00080-4: Chip Capacitor, 4.7µF +/-40%, 25V, 0805, Thickness 1.45 mm; Tolerance: 20%; Voltage Rating: 25V; Min Operating Temperature: -55°C; Max Operating Temperature: 85°C; Pins: 2; Mounting Technology: SMT; Case/Package: 0805
D3 = CMP-004-00064-1: Diode Zener 10V 3W DO214AA; RoHS Compliant: Yes; Max Operating Temperature: 150°C; Min Operating Temperature: -55°C; Diode Type: ZENER; Pins: 2
D4 D6 = CMP-004-00061-1: Rectifier Diode, 1 Phase, 1 Element, 1A, 800V V(RRM), Silicon; RoHS Compliant: Yes; Diode Type: RECTIFIER; Diode Element Material: SILICON; Min Operating Temperature: -55°C; Pins: 2; JESD-30 Code: R-PDSO-F2; Max Operating Temperature: 150°C
D5 = CMP-004-00062-2: Rectifier Diode, Schottky, 1 Phase, 1 Element, 0.2A, 30V V(RRM), Silicon; Forward Voltage: 550mV; Diode Element Material: SILICON; RoHS Compliant: Yes; Min Operating Temperature: -65°C; Pins: 2; Diode Type: RECTIFIER; Max Operating Temperature: 150°C
DS2 = CMP-007-00022-2: LED Uni-Color Green, 100 mW, 30 mA, -55 to 85 degC, 2-Pin SMD, RoHS, Tape and Reel; Manufacturer: Lite-On; Power: 100mW; Forward Voltage: 2.1V; Viewing Angle: 130degrees; Forward Current: 20mA; Luminous Intensity: 6mcd; Lens Style: Clear; Manufacturer URL: http://www.us.liteon.com/; RoHS Compliant: True; Colour: Green; Package Description: 2-Pin Surface Mount Device, Body 1.6 x 0.8 mm; Datasheet URL: http://datasheet.octopart.com/LTST-C190GKT-Lite-On-datasheet-158530.pdf; Datasheet Version: Dec-06; Mounting Technology: SM; Case/Package: 0603; Package Reference: C190GKT; Packaging: TapeandReel; Min Operating Temperature: -55°C; Nominal Vf: 2.1V; Package Quantity: 3000; Illumination Colour: Green; Max Operating Temperature: 85°C; Pins: 2
J9 = CMP-002-00115-1: Micro-Fit+ Vertical Header, Through Hole, 3.00mm Pitch, Single Row, 2 Circuits, Matte Tin (Sn) Plating, Glow-Wire Capable, Black; Max Current Rating: 12.5A; Voltage Rating: 600V; Gender: Male; Rows: 1; Connector Type: PCB Header; Min Operating Temperature: -40°C; Pins: 2; ComponentLink1Description: Datasheet; ComponentLink1URL: https://www.molex.com/en-us/products/part-detail/2165711002?display=pdf; Mounting Technology: Thru-hole; Max Operating Temperature: 105°C
JP2 = CMP-023-000020-4: 2 position solder jumper, no BOM; Source: Zips_Racing_Electric.SchLib; Design Item ID: SOLDER_JUMPER_2
L1 = CMP-006-00027-1: General Purpose Inductor, 1000uH, 20%, 1 Element, SMD; Inductor Application: POWER INDUCTOR; Max Current Rating: 400mA; DC Resistance (DCR): 3.2R; Self Resonant Frequency: 1.7MHz; Tolerance: 20%; Inductance-Nom (L): 1000uH; Max Operating Temperature: 125°C; Inductor Type: GENERAL PURPOSE INDUCTOR; RoHS Compliant: Yes; Pins: 2; Min Operating Temperature: -40°C; Surface Mount: Yes
PS2 = CMP-019-00059-2: DC-DC Unregulated Power Supply Module, 1 Output, 1W, Hybrid; Reach SVHC Compliant: Yes; RoHS Compliant: Yes; Throw Configuration: DC-DC UNREGULATED POWER SUPPLY MODULE
Q1 = CMP-013-00036-1: N-Channel 900 V 6A (Tc) 110W (Tc) Surface Mount DPAK; Min Operating Temperature: -55°C; Case/Package: DPAK; Max Operating Temperature: 150°C; RoHS Compliant: Yes
R31 = CMP-00027-1: Resistor, 0603, 1%, 1/10W; Power: 100mW; Datasheet: https://www.seielect.com/catalog/sei-rmcf_rmcp.pdf; Max Operating Temperature: 155°C; Tolerance: 1%; Min Operating Temperature: -55°C
R32 = CMP-009-00017-5: as R21 on sheet TS Precharge and TSAL; RoHS Compliant: True; Min Operating Temperature: -55°C; Pins: 2; Case/Package: 0603; Mounting Technology: SM; Max Operating Temperature: 155°C; Tolerance: 1%
R33 = CMP-00028-1: Resistor, 0603, 1%, 1/10W; Power: 100mW; Max Operating Temperature: 155°C; Min Operating Temperature: -55°C; Tolerance: 1%; Datasheet: https://www.seielect.com/catalog/sei-rmcf_rmcp.pdf
R34 = CMP-00029-1: Resistor, 0603, 1%, 1/10W; Power: 100mW; Tolerance: 1%; Datasheet: https://www.seielect.com/catalog/sei-rmcf_rmcp.pdf; Max Operating Temperature: 155°C; Min Operating Temperature: -55°C
R35 = CMP-009-00286-1: Fixed Resistor, Metal Glaze/thick Film, 0.5W, 0.22ohm, 0.3317V, 1% +/-Tol, 0,250ppm/Cel, Surface Mount, 1206; Power: 500mW; Min Operating Temperature: -55°C; Pins: 2; Max Operating Temperature: 125°C; RoHS Compliant: Yes; Tolerance: 1%; Mounting Technology: Surface Mount; Case/Package: 1206
R36 = CMP-009-00198-1: as R1 on sheet Main; Case/Package: 0603; Power: 100mW; Mounting Technology: Surface Mount; Min Operating Temperature: -55°C; Max Operating Temperature: 155°C; RoHS Compliant: Yes; Pins: 2
R37 = CMP-009-00014-5: as R29 on sheet TS Precharge and TSAL; Mounting Technology: SM; Pins: 2; Case/Package: 0603; Min Operating Temperature: -55°C; RoHS Compliant: True; Max Operating Temperature: 155°C
U6 = CMP-031-00006-6: Switching Controller, Current-mode, 142kHz Switching Freq-Max, PDSO16; Max Supply Voltage: 600V; Min Supply Voltage: 16V; Min Operating Temperature: -40°C; Max Operating Temperature: 125°C; Pins: 20; Case/Package: 20(16)-Lead TSSOP; Mounting Technology: SMD

## Sheet High Voltage.SchDoc
size Tabloid; SheetNumber: 2; SheetTotal: 5
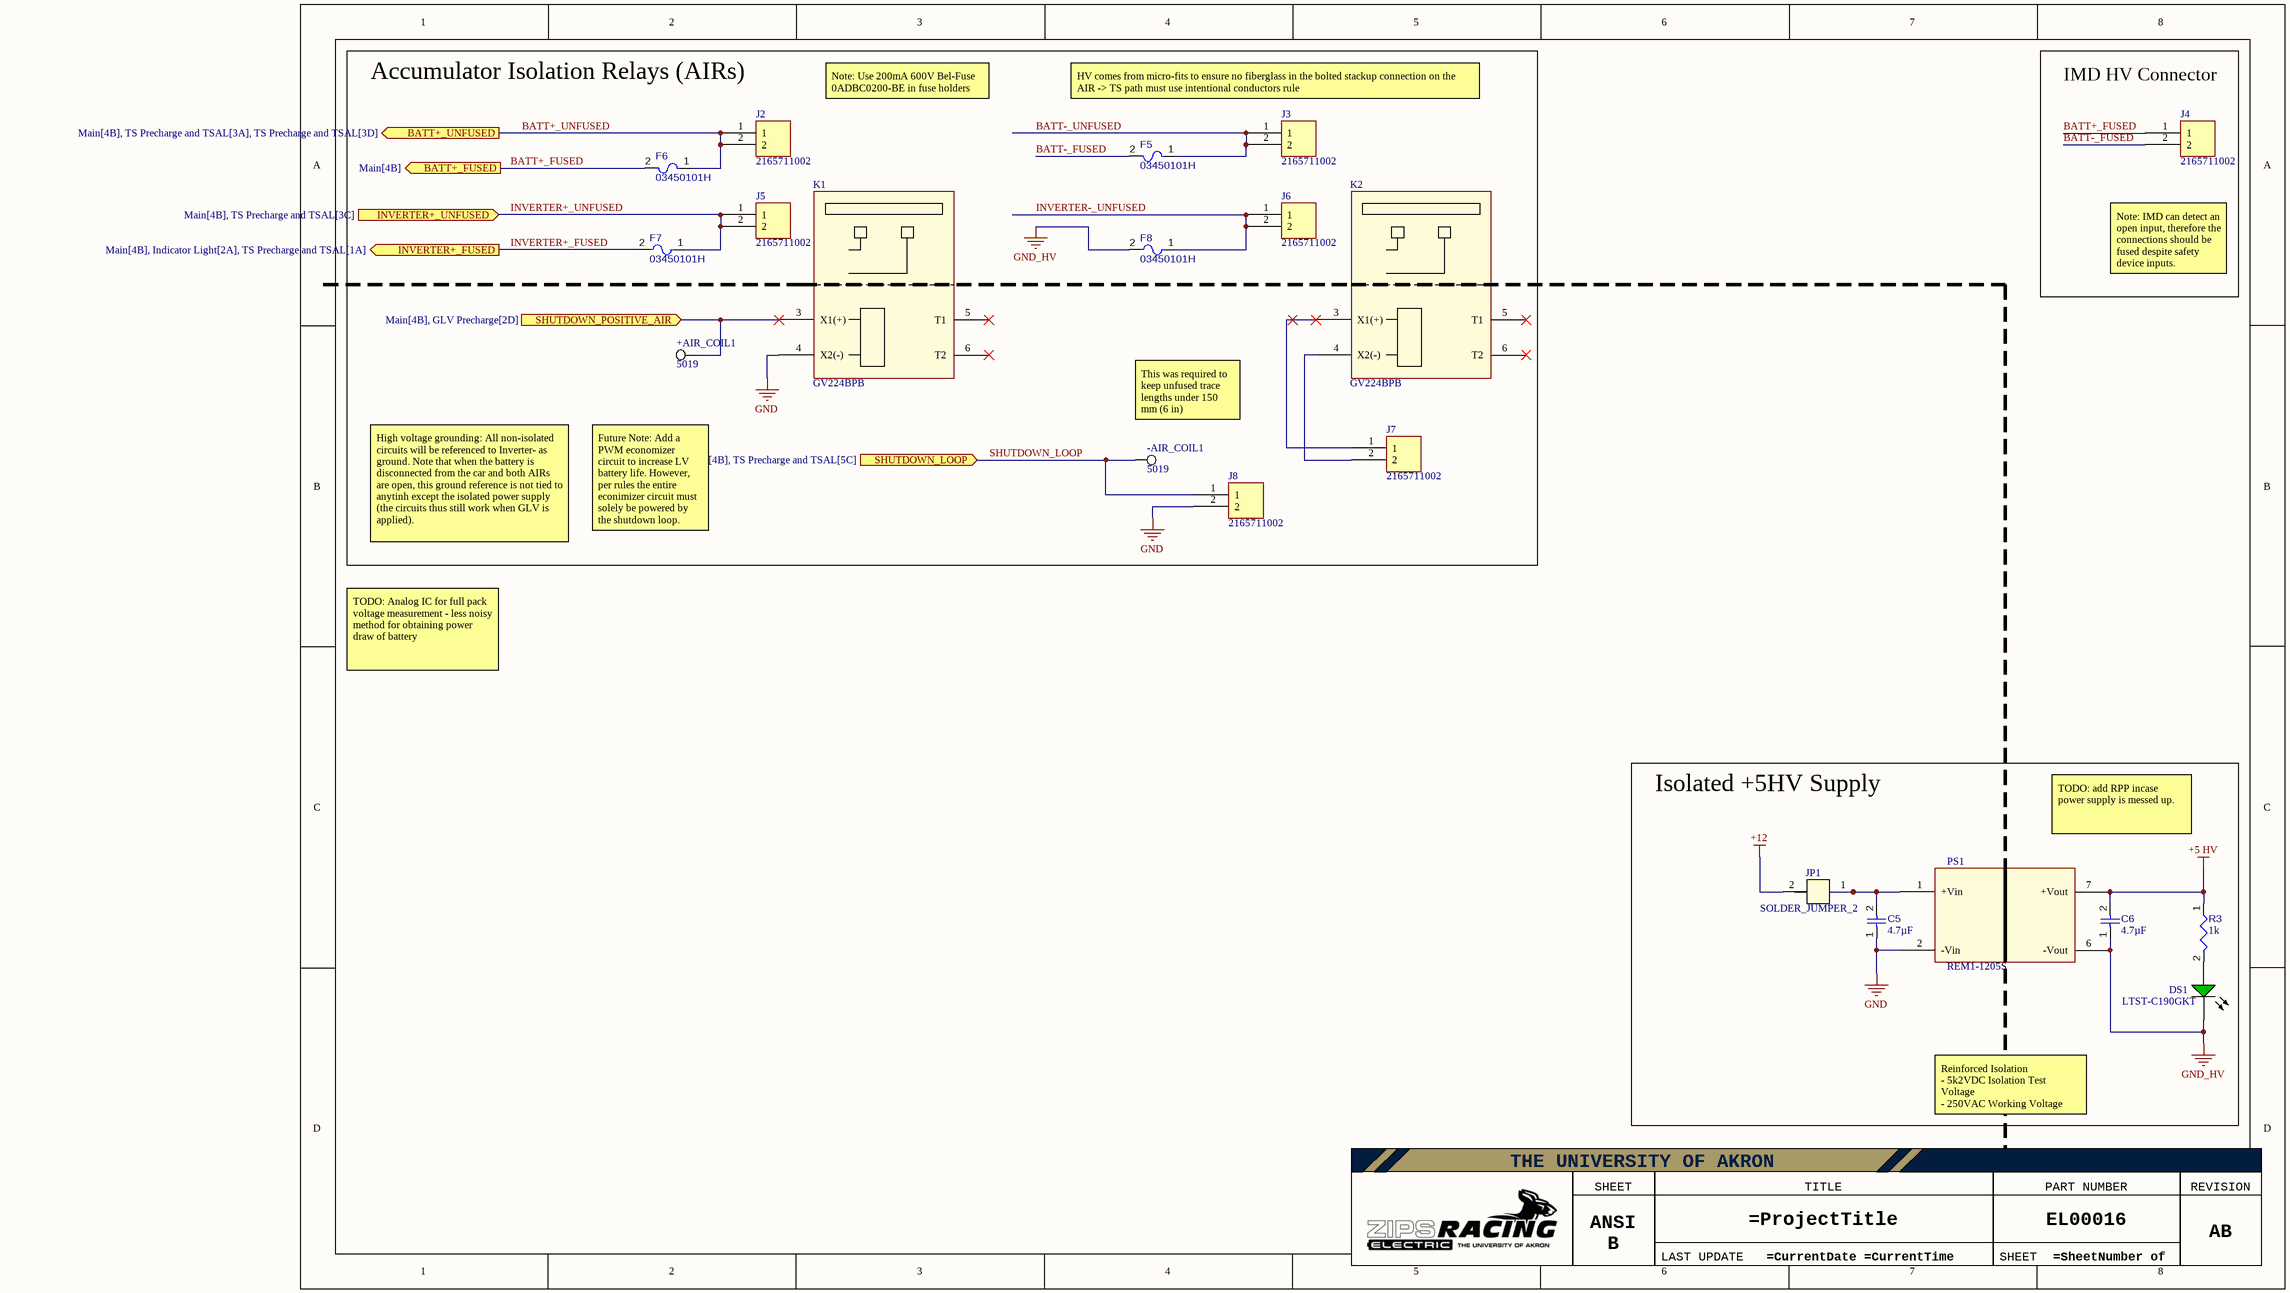
[diagram p3: High Voltage.SchDoc]

### Parts
+AIR_COIL1  5019  [KSTN-5019_V]
-AIR_COIL1  5019  [KSTN-5019_V]
C5  value 4.7µF  [CAPC0805(2012)145_L]  (hidden comment: Capacitor 4.7µF +/-40% 25V 0805)
C6  value 4.7µF  [CAPC0805(2012)145_L]  (hidden comment: Capacitor 4.7µF +/-40% 25V 0805)
DS1  LTST-C190GKT  [LTST-C190GKT_V]
F5  03450101H  [03450101H-Footprint-1]
F6  03450101H  [03450101H-Footprint-1]
F7  03450101H  [03450101H-Footprint-1]
F8  03450101H  [03450101H-Footprint-1]
J2  2165711002  [FP-216571-1002-MFG]
J3  2165711002  [FP-216571-1002-MFG]
J4  2165711002  [FP-216571-1002-MFG]
J5  2165711002  [FP-216571-1002-MFG]
J6  2165711002  [FP-216571-1002-MFG]
J7  2165711002  [FP-216571-1002-MFG]
J8  2165711002  [FP-216571-1002-MFG]
JP1  SOLDER_JUMPER_2  [C0603_JUMPER]  (no BOM)
K1  GV224BPB  [GV225BPX-Footprint-1]
K2  GV224BPB  [GV225BPX-Footprint-1]
PS1  REM1-1205S  [REM1-1205S-Footprint-1]
R3  value 1k  [RESC1608X55X25ML10T15]  (hidden comment: Resistor 1k +/-1% 0603 100 mW)

### Blocks framed on the sheet
Accumulator Isolation Relays (AIRs): +AIR_COIL1 -AIR_COIL1 F5-F8 J2 J3 J5-J8 K1 K2
IMD HV Connector: J4
Isolated +5HV Supply: C5 C6 DS1 JP1 PS1 R3

### Ports
BATT+_FUSED (out, see Main[4B]), BATT+_UNFUSED (out, see Main[4B], TS Precharge and TSAL[3A], TS Precharge and TSAL[3D]), INVERTER+_FUSED (out, see Main[4B], Indicator Light[2A], TS Precharge and TSAL[1A]), INVERTER+_UNFUSED (in, see Main[4B], TS Precharge and TSAL[3C]), SHUTDOWN_LOOP (in, see Main[4B], TS Precharge and TSAL[5C]), SHUTDOWN_POSITIVE_AIR (in, see Main[4B], GLV Precharge[2D])

### Nets
+5 HV: C6.2 PS1.7(+Vout) R3.1
+12: JP1.2
GND: C5.1 J8.2 K1.4(X2(-)) PS1.2(-Vin)
GND_HV: C6.1 DS1.2(K) F8.2 PS1.6(-Vout)
12V_PRECHARGE_STATUS: +AIR_COIL1.1 K1.3(X1(+)) ; port SHUTDOWN_POSITIVE_AIR
BATT+_FUSED: F6.2 J4.1 ; port BATT+_FUSED
BATT+_UNFUSED: F6.1 J2.1 J2.2 ; port BATT+_UNFUSED
BATT-_FUSED: F5.2 J4.2
BATT-_UNFUSED: F5.1 J3.1 J3.2
INVERTER+_FUSED: F7.2 ; port INVERTER+_FUSED
INVERTER+_UNFUSED: F7.1 J5.1 J5.2 ; port INVERTER+_UNFUSED
INVERTER-_UNFUSED: F8.1 J6.1 J6.2
SHUTDOWN_LOOP: -AIR_COIL1.1 J8.1 ; port SHUTDOWN_LOOP  [project net 12V_SHUTDOWN_LOOP]
NetC5_2: C5.2 JP1.1 PS1.1(+Vin)
NetDS1_1: DS1.1(A) R3.2
NetJ7_1: J7.1 K2.3(X1(+))
NetJ7_2: J7.2 K2.4(X2(-))

Not connected (* = marked no-connect by the designer): K1 5(T1)* 6(T2)*; K2 5(T1)* 6(T2)*; PS1 3(NC) 4(NC) 5(NC)

### Notes on the sheet
- Note: Use 200mA 600V Bel-Fuse 0ADBC0200-BE in fuse holders
- (near J3) HV comes from micro-fits to ensure no fiberglass in the bolted stackup connection on the AIR -> TS path must use intentional conductors rule
- Note: IMD can detect an open input, therefore the connections should be fused despite safety device inputs.
- (near -AIR_COIL1) This was required to keep unfused trace lengths under 150 mm (6 in)
- High voltage grounding: All non-isolated circuits will be referenced to Inverter- as ground. Note that when the battery is disconnected from the car and both AIRs are open, this ground reference is not tied to anytinh except the isolated power supply (the circuits thus still work when GLV is applied).
- Future Note: Add a PWM economizer circuit to increase LV battery life. However, per rules the entire econimizer circuit must solely be powered by the shutdown loop.
- TODO: Analog IC for full pack voltage measurement - less noisy method for obtaining power draw of battery
- TODO: add RPP incase power supply is messed up.
- Reinforced Isolation
  - 5k2VDC Isolation Test Voltage
  - 250VAC Working Voltage
- THE UNIVERSITY OF AKRON
- SHEET SIZE
- TITLE
- PART NUMBER
- REVISION
- ANSI B
- LAST UPDATE
- SHEET

### Library data of the parts
+AIR_COIL1 -AIR_COIL1 = CMP-00012-1: Interconnection Device
C5 C6 = CMP-001-00080-4: as C19 on sheet Indicator Light; Voltage Rating: 25V; Min Operating Temperature: -55°C; Max Operating Temperature: 85°C; Pins: 2; Mounting Technology: SMT; Case/Package: 0805
DS1 = CMP-007-00022-2: as DS2 on sheet Indicator Light; Manufacturer URL: http://www.us.liteon.com/; RoHS Compliant: True; Colour: Green; Package Description: 2-Pin Surface Mount Device, Body 1.6 x 0.8 mm; Datasheet URL: http://datasheet.octopart.com/LTST-C190GKT-Lite-On-datasheet-158530.pdf; Datasheet Version: Dec-06; Mounting Technology: SM; Case/Package: 0603; Package Reference: C190GKT; Packaging: TapeandReel; Min Operating Temperature: -55°C; Nominal Vf: 2.1V; Package Quantity: 3000; Illumination Colour: Green; Max Operating Temperature: 85°C; Pins: 2
F5-F8 = CMP-005-00013-2: Littelfuse 3AG 600VDC Fuse Holder; Voltage Rating: 600V; Mounting Technology: Through-Hole; Max Operating Temperature: -40°C; Pins: 2; Min Operating Temperature: 85°C; ComponentLink1Description: Datasheet; ComponentLink1URL: https://m.littelfuse.com/~/media/electronics/datasheets/fuse_holders/littelfuse_fuse_holder_345_hv_datasheet.pdf.pdf
J2-J8 = CMP-002-00115-1: as J9 on sheet Indicator Light; Min Operating Temperature: -40°C; Pins: 2; ComponentLink1Description: Datasheet; ComponentLink1URL: https://www.molex.com/en-us/products/part-detail/2165711002?display=pdf; Mounting Technology: Thru-hole; Max Operating Temperature: 105°C
JP1 = CMP-023-000020-4: 2 position solder jumper, no BOM; Source: Zips_Racing_Electric.SchLib; Design Item ID: SOLDER_JUMPER_2
K1 K2 = CMP-008-00008-5: Contactors - Electromechanical CONTACTOR; Contact Form: SPST-NO; Rated Cycles: 1,000,000; Coil Current: 0.68A; Max Supply Voltage: 800V; Coil Voltage Nominal: 12V; Max Coil Voltage: 16V; Min Operating Temperature: -55°C; Pins: 4; Mounting Technology: PCB Mount; Max Operating Temperature: 85°C
PS1 = CMP-019-00059-2: as PS2 on sheet Indicator Light; Throw Configuration: DC-DC UNREGULATED POWER SUPPLY MODULE; RoHS Compliant: Yes; Reach SVHC Compliant: Yes
R3 = CMP-009-00014-5: as R29 on sheet TS Precharge and TSAL; Mounting Technology: SM; Pins: 2; Case/Package: 0603; Min Operating Temperature: -55°C; RoHS Compliant: True; Max Operating Temperature: 155°C